# EAGLE schematic KnobsController (EAGLE 9.4.2)

## Sheet 1 of 2
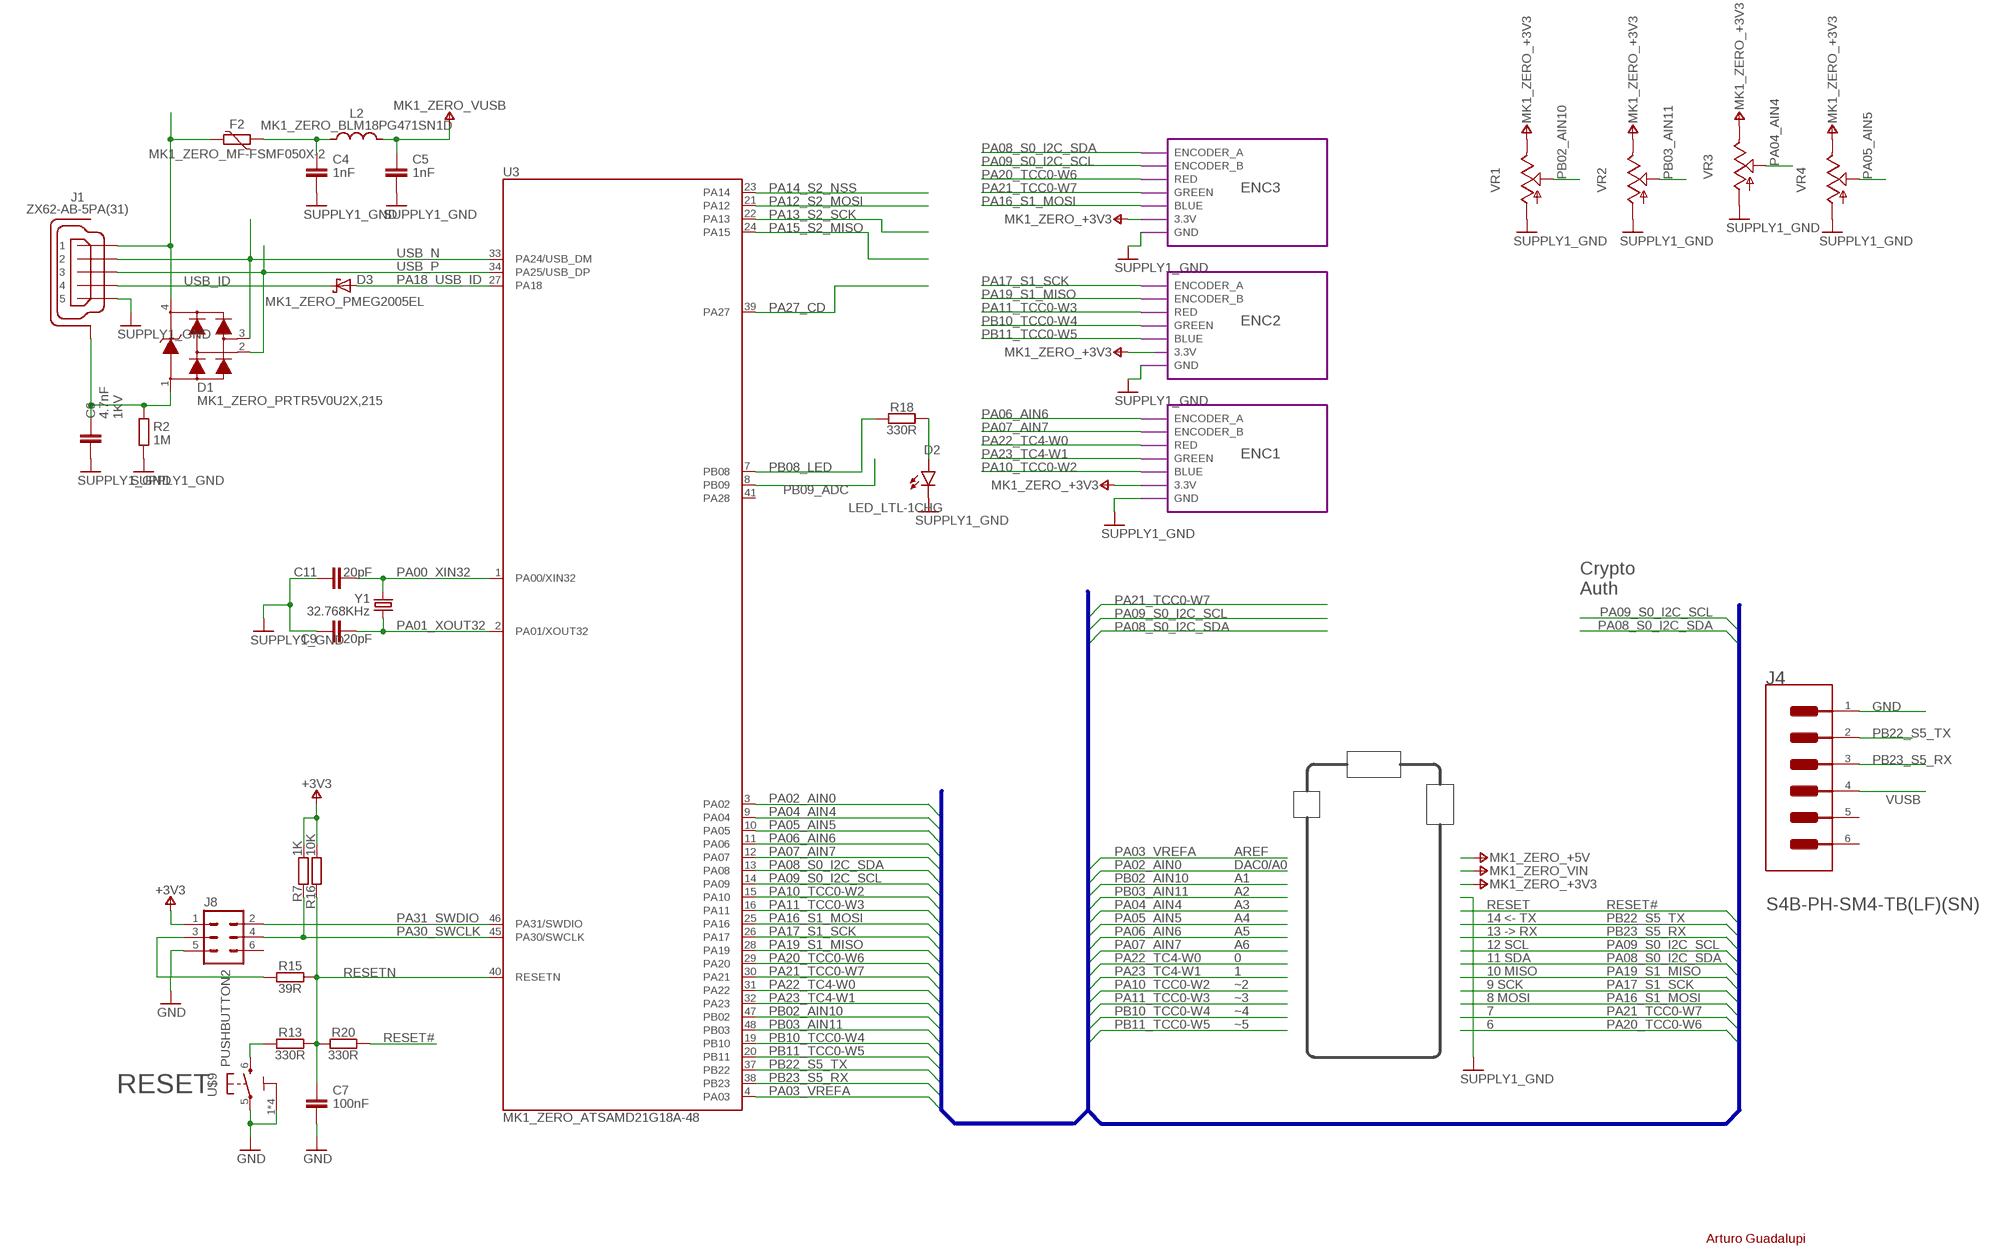
[diagram p0: schematic, sheet 1]

### Parts
C4  1nF  RESISTOR-NICK_C-EUC0805  [RESISTOR-NICK_C0805]
C5  1nF  RESISTOR-NICK_C-EUC1206  [RESISTOR-NICK_C1206]
C6  4.7nF  RESISTOR-NICK_C-EUC0805  [RESISTOR-NICK_C0805]
C7  100nF  C-EUC0805  [C0805]
C9  20pF  RESISTOR-NICK_C-EUC0805  [RESISTOR-NICK_C0805]
C11  20pF  RESISTOR-NICK_C-EUC0805  [RESISTOR-NICK_C0805]
D1  MK1_ZERO_PRTR5V0U2X,215  [MK1_ZERO_SOT190P230X110-4N]
D2  LED_LTL-1CHG  [LED_RADIAL_3MM]
D3  MK1_ZERO_PMEG2005EL  [MK1_ZERO_SODFL1008X40N-882D]
F2  MK1_ZERO_MF-FSMF050X-2  [MK1_ZERO_0603-F1608X100N]
J1  ZX62-AB-5PA(31)  MK1_ZERO_ZX62AB-5PA(11)  [MK1_ZERO_USBMICRO-ZX62-AB-5PA]
J4  JST---S4B-PH-SM4-TB(LF)(SN)_JST_S4B-PH-SM4-TB_LF_SNJST_S4B-PH-SM4-TB_LF_SN_0_0  [JST---S4B-PH-SM4-TB(LF)(SN)_JST_S4B-PH-SM4-TB_LF_SN_0]
J8  2X3_SMD_MALE  [2X3_SMT]
L2  MK1_ZERO_BLM18PG471SN1D  [MK1_ZERO_0603-1608X90N]
R2  1M  RESISTOR-NICK_R-EU_R0805  [RESISTOR-NICK_R0805]
R7  1K  R-EU_R0805  [R0805]
R13  330R  R-EU_R0805  [R0805]
R15  39R  R-EU_R0805  [R0805]
R16  10K  R-EU_R0805  [R0805]
R18  330R  RESISTOR-NICK_R-EU_R0805  [RESISTOR-NICK_R0805]
R20  330R  R-EU_R0805  [R0805]
U3  MK1_ZERO_ATSAMD21G18A-48  [MK1_ZERO_QFN50P700X700X90-49XN-EPSQ515]
U$9  PUSHBUTTON2  [C&K_PTS820_NOPEGS]
VR1  MUSICTHINGMODULAR_9MM_SNAP-IN_POT_  [MUSICTHINGMODULAR_9MM_SNAP-IN_POT]
VR2  MUSICTHINGMODULAR_9MM_SNAP-IN_POT_  [MUSICTHINGMODULAR_9MM_SNAP-IN_POT]
VR3  MUSICTHINGMODULAR_9MM_SNAP-IN_POT_  [MUSICTHINGMODULAR_9MM_SNAP-IN_POT]
VR4  MUSICTHINGMODULAR_9MM_SNAP-IN_POT_  [MUSICTHINGMODULAR_9MM_SNAP-IN_POT]
Y1  32.768KHz  MK1_ZERO_ABS07-32.768KHZ-T  [MK1_ZERO_QUARZO-ABS07]

### Module instances
ENC1 = RGB_ROTARY_ENCODER
ENC2 = RGB_ROTARY_ENCODER
ENC3 = RGB_ROTARY_ENCODER

### Nets
+3V3 [POWER]: J8.1 R7.2 R16.2 VR1.3(E) VR2.3(E) VR3.3(E) VR4.3(E) ; port ENC1.3.3V ENC3.3.3V ; supply symbol labelled MK1_ZERO_+3V3 ; also sheet 2
GND [POWER]: C4.2 C5.2 C6.2 C7.2 C9.1 C11.1 D2.C J1.5 J4.1 J8.5 R2.1 U$9.1 U$9.2 U$9.3 U$9.4 U$9.5 VR1.1(A) VR2.1(A) VR3.1(A) VR4.1(A) ; port ENC1.GND ENC3.GND ENC2.GND ; supply symbol labelled SUPPLY1_GND ; also sheet 2
N17650912: D1.4 F2.2 J1.1
N17658775: R13.1 U$9.6
N$1: C6.1 D1.1 J1.6(SH) J1.7(SH) J1.8(SH) J1.9(SH) J1.10(SH) J1.11(SH) R2.2
N$2: C4.1 F2.1 L2.1
N$4: J8.3 R15.1
N$6: D2.A R18.2
PA00_XIN32: C11.2 U3.1(PA00/XIN32) Y1.2
PA01_XOUT32: C9.2 U3.2(PA01/XOUT32) Y1.1
PA02_AIN0: U3.3(PA02)
PA03_VREFA: U3.4(PA03)
PA04_AIN4: U3.9(PA04) VR3.2(S)
PA05_AIN5: U3.10(PA05) VR4.2(S)
PA06_AIN6: U3.11(PA06) ; port ENC1.ENCODER_A
PA07_AIN7: U3.12(PA07) ; port ENC1.ENCODER_B
PA08_S0_I2C_SDA: U3.13(PA08) ; port ENC3.ENCODER_A
PA09_S0_I2C_SCL: U3.14(PA09) ; port ENC3.ENCODER_B
PA10_TCC0-W2: U3.15(PA10) ; port ENC1.BLUE
PA11_TCC0-W3: U3.16(PA11) ; port ENC2.RED
PA12_S2_MOSI: U3.21(PA12)
PA13_S2_SCK: U3.22(PA13)
PA14_S2_NSS: U3.23(PA14)
PA15_S2_MISO: U3.24(PA15)
PA16_S1_MOSI: U3.25(PA16) ; port ENC3.BLUE
PA17_S1_SCK: U3.26(PA17) ; port ENC2.ENCODER_A
PA18_USB_ID: D3.A U3.27(PA18)
PA19_S1_MISO: U3.28(PA19) ; port ENC2.ENCODER_B
PA20_TCC0-W6: U3.29(PA20) ; port ENC3.RED
PA21_TCC0-W7: U3.30(PA21) ; port ENC3.GREEN
PA22_TC4-W0: U3.31(PA22) ; port ENC1.RED
PA23_TC4-W1: U3.32(PA23) ; port ENC1.GREEN
PA27_CD: U3.39(PA27)
PA30_SWCLK: J8.4 R7.1 U3.45(PA30/SWCLK)
PA31_SWDIO: J8.2 U3.46(PA31/SWDIO)
PB02_AIN10: U3.47(PB02) VR1.2(S)
PB03_AIN11: U3.48(PB03) VR2.2(S)
PB08_LED: R18.1 U3.7(PB08)
PB09_ADC: U3.8(PB09)
PB10_TCC0-W4: U3.19(PB10) ; port ENC2.GREEN
PB11_TCC0-W5: U3.20(PB11) ; port ENC2.BLUE
PB22_S5_TX: J4.2 U3.37(PB22)
PB23_S5_RX: J4.3 U3.38(PB23)
RESET#: R20.2
RESETN: C7.1 R13.2 R15.2 R16.1 R20.1 U3.40(RESETN)
USB_ID: D3.C J1.4
USB_N: D1.3 J1.2 U3.33(PA24/USB_DM)
USB_P: D1.2 J1.3 U3.34(PA25/USB_DP)
VUSB [POWER]: C5.1 J4.4 L2.2 ; supply symbol labelled MK1_ZERO_VUSB ; also sheet 2
Unconnected: J4.5(MNT_1) J4.6(MNT_2) J8.6 U3.41(PA28)

### Buses
PA02_AIN0,PA03_VREFA,PA04_AIN4,PA05_AIN5,PA06_AIN6,PA07_AIN7,PA08_S0_I2C_SDA,PA09_S0_I2C_SCL,PA10_TCC0-W2,PA11_TCC0-W3,PA16_S1_MOSI,PA17_S1_SCK,PA19_S1_MISO,PA20_TCC0-W6,PA21_TCC0-W7,PA22_TC4-W0,PA23_TC4-W1,PB02_AIN10,PB03_AIN11,PB10_TCC0-W4,PB11_TCC0-W5,PB22_S5_TX,PB23_S5_RX,RESET#

### Notes on the sheet
- Crypto
  Auth
- AREF
- DAC0/A0
- A1
- A2
- A3 | RESET
- A4 | 14 <- TX
- A5 | 13 -> RX
- A6 | 12 SCL
- 0 | 11 SDA
- 1 | 10 MISO
- ~2 | 9 SCK
- ~3 | 8 MOSI
- ~4 | 7
- ~5 | 6
- RESET
- Arturo Guadalupi

## Sheet 2 of 2
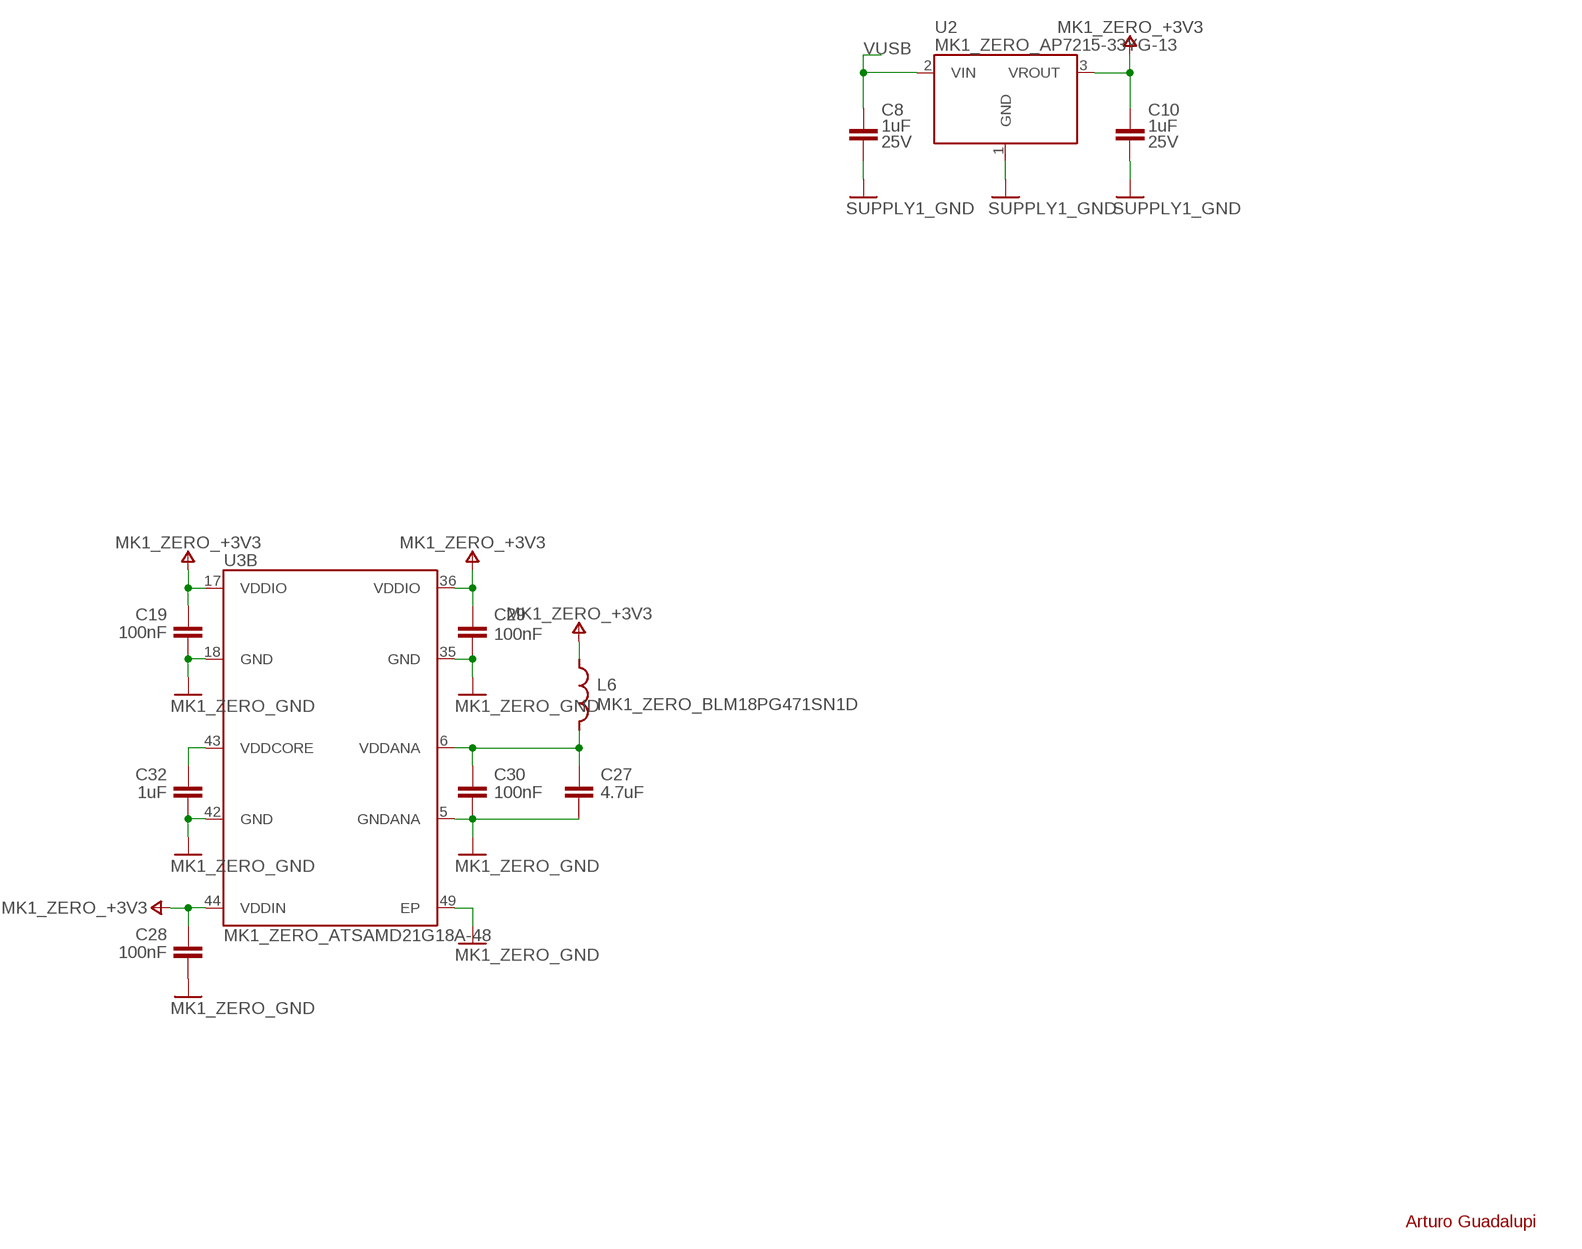
[diagram p1: schematic, sheet 2]

### Parts
C8  1uF  RESISTOR-NICK_C-EUC0805  [RESISTOR-NICK_C0805]
C10  1uF  RESISTOR-NICK_C-EUC0805  [RESISTOR-NICK_C0805]
C19  100nF  RESISTOR-NICK_C-EUC0805  [RESISTOR-NICK_C0805]
C27  4.7uF  RESISTOR-NICK_C-EUC0805  [RESISTOR-NICK_C0805]
C28  100nF  RESISTOR-NICK_C-EUC0805  [RESISTOR-NICK_C0805]
C29  100nF  RESISTOR-NICK_C-EUC0805  [RESISTOR-NICK_C0805]
C30  100nF  RESISTOR-NICK_C-EUC0805  [RESISTOR-NICK_C0805]
C32  1uF  RESISTOR-NICK_C-EUC0805  [RESISTOR-NICK_C0805]
L6  MK1_ZERO_BLM18PG471SN1D  [MK1_ZERO_0603-1608X90N]
U2  MK1_ZERO_AP7215-33YG-13  [MK1_ZERO_SOT150P400X160-3N]

### Nets
+3V3 [POWER]: C10.1 C19.1 C28.1 C29.1 L6.1 U2.3(VROUT) U3.17(VDDIO) U3.36(VDDIO) U3.44(VDDIN) ; supply symbol labelled MK1_ZERO_+3V3 ; also sheet 1
GND [POWER]: C8.2 C10.2 C19.2 C27.2 C28.2 C29.2 C30.2 C32.2 U2.1(GND) U3.5(GNDANA) U3.18(GND) U3.35(GND) U3.42(GND) U3.49(EP) ; supply symbol labelled MK1_ZERO_GND, SUPPLY1_GND ; also sheet 1
N17852357: C27.1 C30.1 L6.2 U3.6(VDDANA)
N17852431: C32.1 U3.43(VDDCORE)
VUSB [POWER]: C8.1 U2.2(VIN) ; also sheet 1

### Notes on the sheet
- Arturo Guadalupi

## Library data of the parts
C4 C5 C9 C11 C19 C27-C30 C32 = MKRZero_V5.0:RESISTOR-NICK_C-EU: CAPACITOR, European symbol
C6 = MKRZero_V5.0:RESISTOR-NICK_C-EU: CAPACITOR, European symbol; VOLTAGE: 1KV
C7 = resistor-nick:C-EU: CAPACITOR, European symbol
C8 C10 = MKRZero_V5.0:RESISTOR-NICK_C-EU: CAPACITOR, European symbol; VOLTAGE: 25V
D1 = MKRZero_V5.0:MK1_ZERO_PRTR5V0U2X,215; DESCR: TVS DIODE 5.5VWM SOT143B; MF: NXP; MPN: PRTR5V0U2X,215
D2 = MKRZero_V5.0:LED_LTL-1CHG: LED RED DIFFUSED T/H Manufacturer's datasheet <https://media.digikey.com/pdf/Data%20Sheets/Lite-On%20PDFs/LTL-1CHG.pdf>; CREATED_BY: PCBLayout.com; DIGIKEY_PART_NUMBER: 160-1710-ND; MANUFACTURER: Lite-On Inc.; MPN: LTL-1CHG; PACKAGE: RADIAL 3MM
D3 = MKRZero_V5.0:MK1_ZERO_PMEG2005EL: DIODE SCHOTTKY 20V 500MA SOD882; DESCR: DIODE SCHOTTKY 20V 500MA SOD882; MF: NXP; MPN: PMEG2005EL,315
F2 = MKRZero_V5.0:MK1_ZERO_MF-FSMF050X-2: FUSE PTC RESET 500MA SMD 0603; DESCR: FUSE PTC RESET 500MA SMD 0603; MF: Bourns Inc; MPN: MF-FSMF050X-2
J1 = MKRZero_V5.0:MK1_ZERO_ZX62AB-5PA(11)
J4 = MKRZero_V5.0:JST---S4B-PH-SM4-TB(LF)(SN)_JST_S4B-PH-SM4-TB_LF_SN: 4 Positions Header Connector 0.079" (2.00mm) Surface Mount, Right Angle Tin; CENTROID_NOT_SPECIFIED: No; DATASHEET: http://www.jst-mfg.com/product/pdf/eng/ePH.pdf; DIGIKEY_DESCRIPTION: CONN HEADER PH SIDE 4POS 2MM SMD; DIGIKEY_PART_NUMBER: 455-1751-1-ND; LEAD_FREE: yes; MF: JST; MPN: S4B-PH-SM4-TB(LF)(SN); PACKAGE: CONN_SMT_HDR4; PREFIX: J; ROHS: yes; TEMPERATURE_RANGE_HIGH: +85°C; TEMPERATURE_RANGE_LOW: -25°C
J8 = MK1_Zero:2X3_SMD_MALE
L2 L6 = MKRZero_V5.0:MK1_ZERO_BLM18PG471SN1D: FERRITE CHIP 470 OHM 1000MA 0603
R2 R18 = MKRZero_V5.0:RESISTOR-NICK_R-EU_: RESISTOR, European symbol
R7 R13 R15 R16 R20 = resistor-nick:R-EU_: RESISTOR, European symbol
U2 = MKRZero_V5.0:MK1_ZERO_AP7215-33YG-13: IC REG LDO 3.3V 0.6A SOT89-3 Datasheet <http://www.diodes.com/_files/datasheets/AP7215.pdf>; DESCR: IC REG LDO 3.3V 0.6A SOT89-3; MF: Diodes Inc; MPN: AP7215-33YG-13
U3 = MKRZero_V5.0:MK1_ZERO_ATSAMD21G18A-48: IC MCU 32BIT 256KB FLASH 48QFN Datasheet (Summary) <http://www.atmel.com/Images/Atmel-42181-SAM-D21_Summary.pdf> Datasheet (Complete) <http://www.atmel.com/Images/Atmel-42181-SAM-D21_Datasheet.pdf>; DESCR: IC MCU 32BIT 256KB FLASH 48QFN; MF: Atmel; MPN: ATSAMD21E18A-MU
U$9 = Arduino-pushbuttons:PUSHBUTTON2: TS42 Dongnan Electronics Tact switch VDC 12V - 50mA
VR1-VR4 = MKRZero_V5.0:MUSICTHINGMODULAR_9MM_SNAP-IN_POT: 9mm vertical snap-in pot, Alpha / Panasonic style
Y1 = MKRZero_V5.0:MK1_ZERO_ABS07-32.768KHZ-T; DESCR: CRYSTAL 32.768KHZ 12.5PF SMD 3.2x1.5mm; MF: Abracon; MPN: ABS07-32.768KHZ-T

## Module RGB_ROTARY_ENCODER
Ports: ENCODER_A(io) ENCODER_B(io) RED(io) GREEN(io) BLUE(io) 3.3V(io) GND(io)
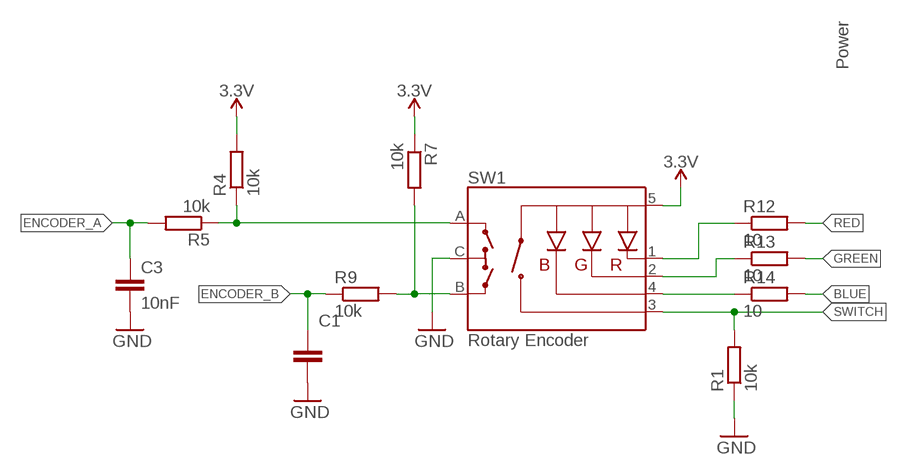
[diagram p2: schematic, module RGB_ROTARY_ENCODER, sheet 1]

### Parts
C1  10nF  C-EUC0805  [C0805]
C3  10nF  C-EUC0805  [C0805]
R1  10k  R-EU_R0805  [R0805]
R4  10k  R-EU_R0805  [R0805]
R5  10k  R-EU_R0805  [R0805]
R7  10k  R-EU_R0805  [R0805]
R9  10k  R-EU_R0805  [R0805]
R12  10  R-EU_R0805  [R0805]
R13  10  R-EU_R0805  [R0805]
R14  10  R-EU_R0805  [R0805]
SW1  Rotary Encoder  ENCODER-RGB-SWITCHKIT  [ENCODER_LED_3_KIT]

### Nets
3.3V: R4.2 R7.1 SW1.5(+)
A: R4.1 R5.1 SW1.A
B: R7.2 R9.2 SW1.B
BLUE: R14.2
BLUE_RAW: R14.1 SW1.4(-B)
ENCODER_A: C3.1 R5.2
ENCODER_B: C1.1 R9.1
GND: C1.2 C3.2 R1.1 SW1.C
GREEN: R13.2
GREEN_RAW: R13.1 SW1.2(-G)
RED: R12.2
RED_RAW: R12.1 SW1.1(-R)
SWITCH: R1.2 SW1.3(SW)

### Notes on the sheet
- Power

### Library data of the parts
C1 C3 = resistor-nick:C-EU: CAPACITOR, European symbol
R1 R4 R5 R7 R9 R12-R14 = resistor-nick:R-EU_: RESISTOR, European symbol
SW1 = SparkFun-Switches:ENCODER-RGB-SWITCH: Illuminated Rotary Encoder w/ RGB LED and select switch Encoders rotate similarly to potentiometers, but they’re different from potentiometers in that an encoder has full rotation without limits. They output gray code so that you can tell how much and in which direction the encoder has been turned. This encoder includes an RGB LED and a push-down select switch. Part #: Top Up EC12PLRGBSDVBF-D <http://top-up.so-buy.com/front/bin/ptdetail.phtml?Part=EC12PLRGBSDVBF-D> SparkFun Products Rotary Encoder - Illuminated (RGB) <https://www.sparkfun.com/products/10982> (COM-10982); PROD_ID: RES-10859; SF_SKU: COM-10982

## Net classes
0 default: width 0.152 mm, drill 0.152 mm, clearance 0.152 mm
1 POWER: width 0.203 mm, drill 0.254 mm, clearance 0.203 mm